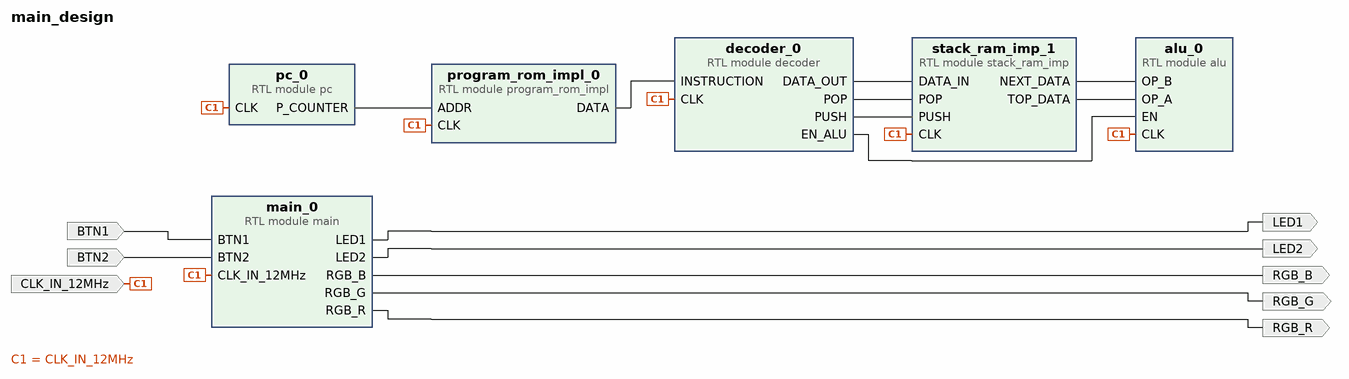
[diagram p0: block diagram of the top level]
# Vivado block design main_design, xc7a35tcpg236-1, Vivado 2024.1
create_bd_design main_design

create_bd_port -dir I BTN1
create_bd_port -dir I BTN2
create_bd_port -dir I CLK_IN_12MHz
create_bd_port -dir O LED1
create_bd_port -dir O LED2
create_bd_port -dir O RGB_B
create_bd_port -dir O RGB_G
create_bd_port -dir O RGB_R

create_bd_cell -type module -reference main main_0
create_bd_cell -type module -reference program_rom_impl program_rom_impl_0
create_bd_cell -type module -reference pc pc_0
create_bd_cell -type module -reference alu alu_0
create_bd_cell -type module -reference decoder decoder_0
create_bd_cell -type module -reference stack_ram_imp stack_ram_imp_1

# ---- connections ----

connect_bd_net -net BTN1_0_1 [get_bd_ports BTN1] [get_bd_pins main_0/BTN1]
connect_bd_net -net BTN2_0_1 [get_bd_ports BTN2] [get_bd_pins main_0/BTN2]
connect_bd_net [get_bd_ports CLK_IN_12MHz] \
  [get_bd_pins pc_0/CLK] [get_bd_pins alu_0/CLK] [get_bd_pins program_rom_impl_0/CLK] [get_bd_pins main_0/CLK_IN_12MHz] \
  [get_bd_pins decoder_0/CLK] [get_bd_pins stack_ram_imp_1/CLK]
connect_bd_net [get_bd_pins decoder_0/DATA_OUT] [get_bd_pins stack_ram_imp_1/DATA_IN]
connect_bd_net [get_bd_pins decoder_0/EN_ALU] [get_bd_pins alu_0/EN]
connect_bd_net [get_bd_pins decoder_0/POP] [get_bd_pins stack_ram_imp_1/POP]
connect_bd_net [get_bd_pins decoder_0/PUSH] [get_bd_pins stack_ram_imp_1/PUSH]
connect_bd_net [get_bd_pins main_0/LED1] [get_bd_ports LED1]
connect_bd_net [get_bd_pins main_0/LED2] [get_bd_ports LED2]
connect_bd_net [get_bd_pins main_0/RGB_B] [get_bd_ports RGB_B]
connect_bd_net [get_bd_pins main_0/RGB_G] [get_bd_ports RGB_G]
connect_bd_net [get_bd_pins main_0/RGB_R] [get_bd_ports RGB_R]
connect_bd_net [get_bd_pins pc_0/P_COUNTER] [get_bd_pins program_rom_impl_0/ADDR]
connect_bd_net [get_bd_pins program_rom_impl_0/DATA] [get_bd_pins decoder_0/INSTRUCTION]
connect_bd_net [get_bd_pins stack_ram_imp_1/NEXT_DATA] [get_bd_pins alu_0/OP_B]
connect_bd_net [get_bd_pins stack_ram_imp_1/TOP_DATA] [get_bd_pins alu_0/OP_A]

validate_bd_design
save_bd_design
